# Altium schematic sheet RS485.SchDoc: RP2040 CNC
size B; Author: AM; CompanyName: Expatria Technologies; DrawnBy: A.Marles; Engineer: AM; Organization: Expatria Technolgoies; Address1: PO Box 2084; Address3: Merritt, BC V1K 1B8; Address4: Canada; DocumentNumber: 26; SheetNumber: 26; SheetTotal: 27
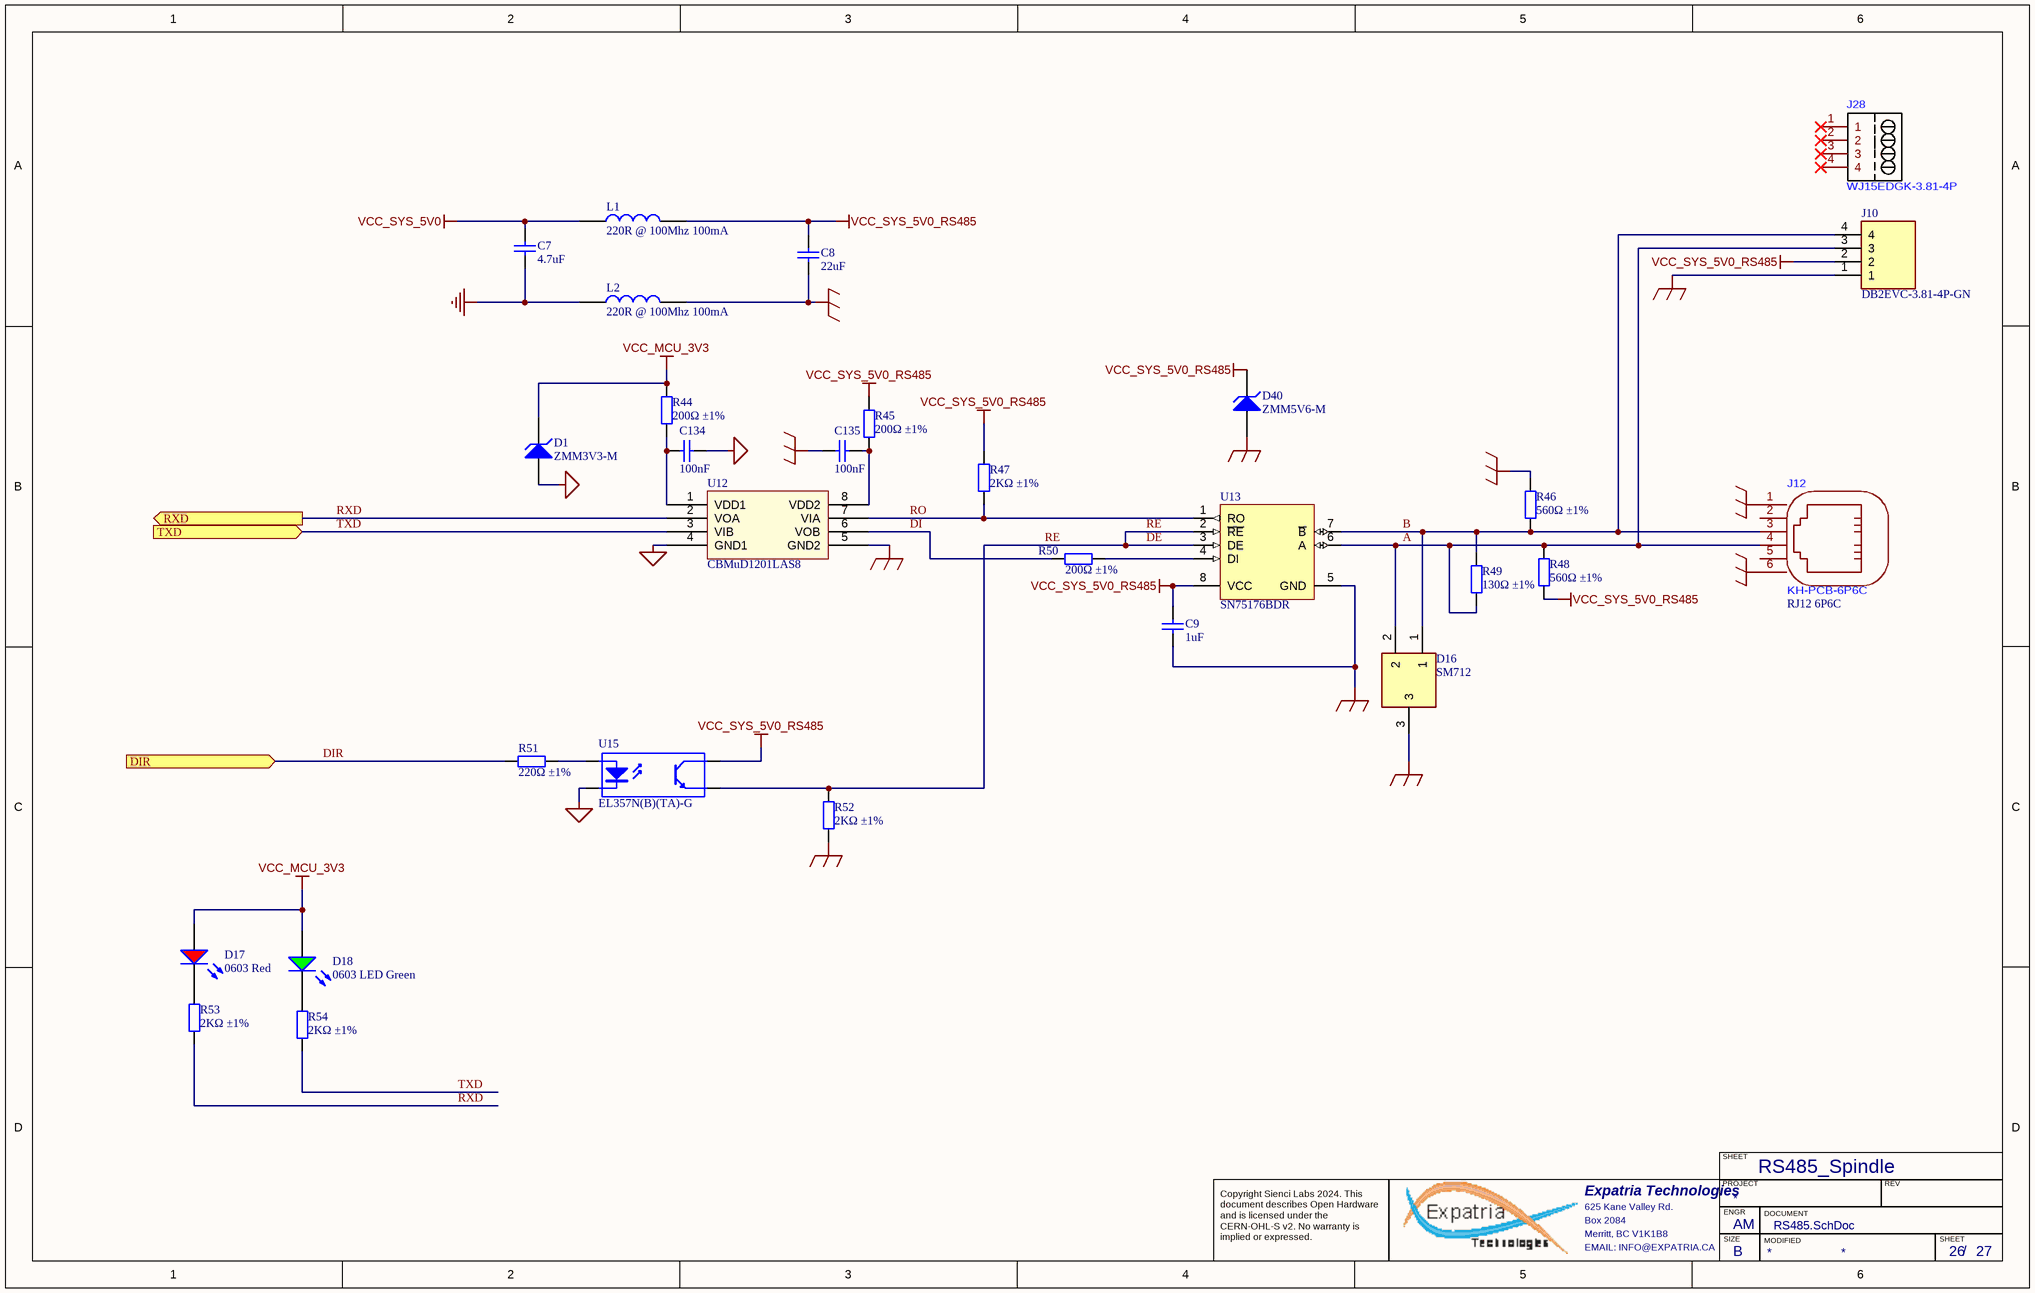
[diagram p0: RS485.SchDoc]

## Parts
C7  4.7uF  [0805_C]
C8  22uF  [0805_C]
C9  1uF  [0603_C]
C134  100nF  [0402_C]
C135  100nF  [0402_C]
D1  ZMM3V3-M  [LL-34]
D16  SM712  [SOT95P230X117-3N]
D17  0603 Red  [0603_LED_S1]
D18  0603 LED Green  [0603_LED_S1 - GREEN]
D40  ZMM5V6-M  [LL-34]
J10  DB2EVC-3.81-4P-GN  [CONN-TH_5P-P3.81_DB2EVC-3.81-4p]
J12  KH-PCB-6P6C  value RJ12 6P6C  [RJ11-TH_DS1133-S60BPX]
J28  WJ15EDGK-3.81-4P  (mechanical)
L1  220R @ 100Mhz 100mA  [0402_L]
L2  220R @ 100Mhz 100mA  [0402_L]
R44  200Ω ±1%  [0402_R]
R45  200Ω ±1%  [0402_R]
R46  560Ω ±1%  [0603_R]
R47  2KΩ ±1%  [0603_R]
R48  560Ω ±1%  [0603_R]
R49  130Ω ±1%  [0603_R]
R50  200Ω ±1%  [0402_R]
R51  220Ω ±1%  [0402_R]
R52  2KΩ ±1%  [0603_R]
R53  2KΩ ±1%  [0603_R]
R54  2KΩ ±1%  [0603_R]
U12  CBMuD1201LAS8  [SOIC-8_150mil]
U13  SN75176BDR  [SOIC-8_150mil]
U15  EL357N(B)(TA)-G  [SOP-4_P2.54]

## Ports
DIR (in), RXD (out), TXD (in)

## Nets
GND: C7.1 L2.1
MCU_GND: C134.2 D1.1(A) U12.4(GND1) U15.2(K)
MOD_GND: C8.1 C9.1 C135.1 D16.3 D40.1(A) J10.1 J12.1(MCLR) J12.6(NC) L2.2 R46.1 R52.1 U12.5(GND2) U13.5(GND)
VCC_MCU_3V3: D1.2(K) D17.A D18.A R44.2
VCC_SYS_5V0: C7.2 L1.1
VCC_SYS_5V0_RS485: C8.2 C9.2 D40.2(K) J10.2 L1.2 R45.2 R47.2 R48.2 U13.8(VCC) U15.4(C)
A: D16.2 J10.3 J12.4(PGD) R48.1 R49.1 U13.6(A)
B: D16.1 J10.4 J12.3(VSS) R46.2 R49.2 U13.7(~{B})
DE: R52.2 U13.2(~{RE}) U13.3(DE) U15.3(E)  [also labelled RE]
DI: R50.2 U12.6(VOB)
DIR: R51.2 ; port DIR
RO: R47.1 U12.7(VIA) U13.1(RO)
RXD: R53.1 U12.2(VOA) ; port RXD
TXD: R54.1 U12.3(VIB) ; port TXD
NetC134_1: C134.1 R44.1 U12.1(VDD1)
NetC135_2: C135.2 R45.1 U12.8(VDD2)
NetD17_K: D17.K R53.2
NetD18_K: D18.K R54.2
NetR50_1: R50.1 U13.4(DI)
NetR51_1: R51.1 U15.1(A)

Not connected (* = marked no-connect by the designer): J12 2(VDD) 5(PGC); J28 1* 2* 3* 4*

## Notes on the sheet
- RS485_Spindle
- SHEET
- Expatria Technologies
- 625 Kane Valley Rd.
- Box 2084
- Merritt, BC V1K1B8
- PROJECT
- SIZE
- ENGR
- MODIFIED
- DOCUMENT
- REV
- Copyright Sienci Labs 2024. This document describes Open Hardware and is licensed under the CERN-OHL-S v2. No warranty is implied or expressed.
- EMAIL: INFO@EXPATRIA.CA
- B
- /

## Library data of the parts
C7 = 0805 4.7uF (475) 10% 25V: Chip capacitors; Manufacturer: Samsung Electro-Mechanics; Manufacturer Part Number: CL21A475KAQNNNE; Tolerance: 10%; Voltage: 25V; ComponentLink1Description: Supplier link; ComponentLink1URL: http://www.szlcsc.com/product/details_2131.html; Package: 0805; Supplier: LCSC; SuppliersPartNumber: C1779; Capacitance: 4.7uF
C8 = 0805 22uF (226) 20% 25V: 25V 22uF X5R ±20% 0805 Multilayer Ceramic Capacitors MLCC - SMD/SMT ROHS; Manufacturer: Samsung Electro-Mechanics; Manufacturer Part Number: CL21A226MAQNNNE; ComponentLink1Description: Supplier link; ComponentLink1URL: http://www.szlcsc.com/product/details_46786.html; Package: 0805; Supplier: LC; SuppliersPartNumber: C45783; Capacitance: 22uF; Tolerance: 20%; Voltage: 25V
C9 = 0603 1uF (105) 10% 50V: Chip capacitors; Manufacturer: Samsung Electro-Mechanics; Manufacturer Part Number: CL10A105KB8NNNC; Tolerance: 10%; Voltage: 50V; ComponentLink1Description: Supplier link; ComponentLink1URL: http://www.szlcsc.com/product/details_16531.html; Package: 0603; Supplier: LCSC; SuppliersPartNumber: C15849; Capacitance: 1uF
C134 C135 = 0402 100nF (104) 10% 16V: 16V 100nF X7R ±10% 0402 Multilayer Ceramic Capacitors MLCC - SMD/SMT ROHS; Manufacturer: Samsung Electro-Mechanics; Manufacturer Part Number: CL05B104KO5NNNC; ComponentLink1Description: Supplier link; ComponentLink1URL: http://www.szlcsc.com/product/details_1877.html; Package: 0402; Supplier: LC; SuppliersPartNumber: C1525; Capacitance: 100nF; Tolerance: 10%; Voltage: 16V
D1 = LL-34 ZMM3V3-M: Single 3.1V~3.5V 500mW 3.3V LL-34 Zener Diodes ROHS; Manufacturer: ST(Semtech); ComponentLink1Description: 供应商链接; ComponentLink1URL: http://www.szlcsc.com/product/details_8541.html; Package: LL-34; Supplier: LC; SuppliersPartNumber: C8056; Manufacturer Part Number: ZMM3V3-M
D16 = CDSOT23-SM712: Bidirectional 12V (Max), 7V (Max) 7.5V / 13.3V 10V / 20V 12A(8/20us) SOT-23-3 TVS RoHS; Manufacturer: DOWO; Height: 1.17mm; SuppliersPartNumber: C293966; Manufacturer Part Number: SM712; Supplier 1: LCSC; Supplier Part Number 1: C293966; Manufacturer 1: DOWO; Manufacturer Part Number 1: SM712; Package: SOT-23-3
D17 = KT-0603R: -40℃~+85℃ Red 0603 Light Emitting Diodes (LED) ROHS; Manufacturer: Hubei KENTO Elec; Package: 0603; Supplier: LC; SuppliersPartNumber: C2286; Color: Red; Manufacturer Part Number: KT-0603R; Value: 0603 Red
D18 = MHT192UGCT: 20mA -40℃~+85℃ 515nm~530nm Emerald 120° 60mW 0603 Light Emitting Diodes (LED) ROHS; Manufacturer: MEIHUA; Package: 0603; Supplier: LC; SuppliersPartNumber: C389519; Color: Green; Manufacturer Part Number: MHT192UGCT
D40 = LL-34 ZMM5V6-M: Single 500mW 5.2V~6V 5.6V LL-34 Zener Diodes ROHS; Manufacturer Part Number: ZMM5V6; Manufacturer: HXY MOSFET; Package: LL-34; Supplier: LC; SuppliersPartNumber: C5345993
J10 = DB2EVC-3.81-4P-GN: 3.81mm Green Board Edge/Receptacle-Close Push-Pull,P=3.81mm Pluggable System Terminal Block ROHS; Manufacturer: DIBO; SuppliersPartNumber: C395697; Manufacturer Part Number: DB2EVC-3.81-4P-GN; Supplier: LCSC; Value: DB2EVC-3.81-4P-GN
J12 = KH-PCB-6P6C: RJ45 RJReceptacle No 1 Shrouded Without LED -45℃~+85℃ Plugin Ethernet Connectors/Modular Connectors (RJ45 RJ11) ROHS; Manufacturer: Shenzhen Kinghelm Elec; Manufacturer Part Number: KH-PCB-6P6C; SuppliersPartNumber: C2683354; Supplier: LCSC
J28 = WJ15EDGK-3.81-4P: 3.81mm Green Plug P=3.81mm Pluggable System Terminal Block ROHS; Manufacturer: Ningbo; SuppliersPartNumber: C7244; Supplier: LCSC; Manufacturer Part Number: WJ15EDGK-3.81-4P; Value: WJ15EDGK-3.81-4P
L1 L2 = 0402 220R@100Mhz 0.1A: 700mΩ ±25% 220Ω@100MHz 0402 Ferrite Beads ROHS; Manufacturer Part Number: CBG100505U221T; Manufacturer: FH (Guangdong Fenghua Advanced Tech); Package: 0402; Supplier: LC; SuppliersPartNumber: C92617
R44 R45 R50 = 0402 200R (2000) 1%: Chip resistor; Manufacturer: Uniroyal Elec; Manufacturer Part Number: 0402WGF2000TCE; Power: 1/16W; ComponentLink1Description: Supplier link; ComponentLink1URL: http://www.szlcsc.com/product/details_25830.html; Package: 0402; Supplier: LC; SuppliersPartNumber: C25087; Resistance: 200Ω; Tolerance: 1%
R46 R48 = 0603 560R (5600) 1%: Chip resistor; Manufacturer: Uniroyal Elec; Manufacturer Part Number: 0603WAF5600T5E; Power: 1/10W; ComponentLink1Description: Supplier link; ComponentLink1URL: http://www.szlcsc.com/product/details_23931.html; Package: 0603; Supplier: LCSC; SuppliersPartNumber: C23204; Resistance: 560Ω; Tolerance: 1%
R47 R52-R54 = 0603 2K (2001) 1%: Chip resistor; Manufacturer: Uniroyal Elec; Manufacturer Part Number: 0603WAF2001T5E; Power: 1/10W; ComponentLink1Description: Supplier link; ComponentLink1URL: http://www.szlcsc.com/product/details_23702.html; Package: 0603; Supplier: LCSC; SuppliersPartNumber: C22975; Resistance: 2KΩ; Tolerance: 1%
R49 = 0603 130R (1300) 1%: Chip resistor; Manufacturer: Uniroyal Elec; Manufacturer Part Number: 0603WAF1300T5E; Power: 1/10W; ComponentLink1Description: Supplier link; ComponentLink1URL: http://www.szlcsc.com/product/details_23523.html; Package: 0603; Supplier: LCSC; SuppliersPartNumber: C22796; Resistance: 130Ω; Tolerance: 1%
R51 = 0402 220R (2200) 1%: Chip resistor; Manufacturer: Uniroyal Elec; Manufacturer Part Number: 0402WGF2200TCE; Power: 1/16W; Package: 0402; Supplier: LC; SuppliersPartNumber: C25091; Resistance: 220Ω; Tolerance: 1%; ComponentLink1Description: Supplier link; ComponentLink1URL: http://www.szlcsc.com/product/details_25834.html
U12 = CBMuD1201LAS8: Dual Channel Isolator; Manufacturer: Corebai Microelectronics; Package: SOIC-8_150mil; Supplier: LC; SuppliersPartNumber: C476472; ComponentLink1Description: 供应商链接; ComponentLink1URL: http://www.szlcsc.com/product/details_10199.html; Manufacturer Part Number: CBMuD1201LAS8
U13 = SN75176BDR_[C7063]: RS-485/RS-422; Manufacturer: Texas Instruments; ComponentLink1Description: 供应商链接; ComponentLink1URL: http://www.szlcsc.com/product/details_7535.html; Package: SOIC-8_150mil; Supplier: LCSC; SuppliersPartNumber: C7063; Manufacturer Part Number: SN75176BDR
U15 = EL357N(B)(TA)-G_[C6649]: Optocoupler SOP-4, EL357N(B)(TA)-G, Everlight Electronics; Package: SOP-4_P2.54; Supplier: LC; SuppliersPartNumber: C6649; Manufacturer: Everlight; Manufacturer Part Number: EL357N(B)(TA)-G